# EAGLE schematic fri3d_badge_2016 (EAGLE 7.5.0)
CNAME: Fri3d Camp Badge; CREVISION: 0; DESIGNER: Christophe VG
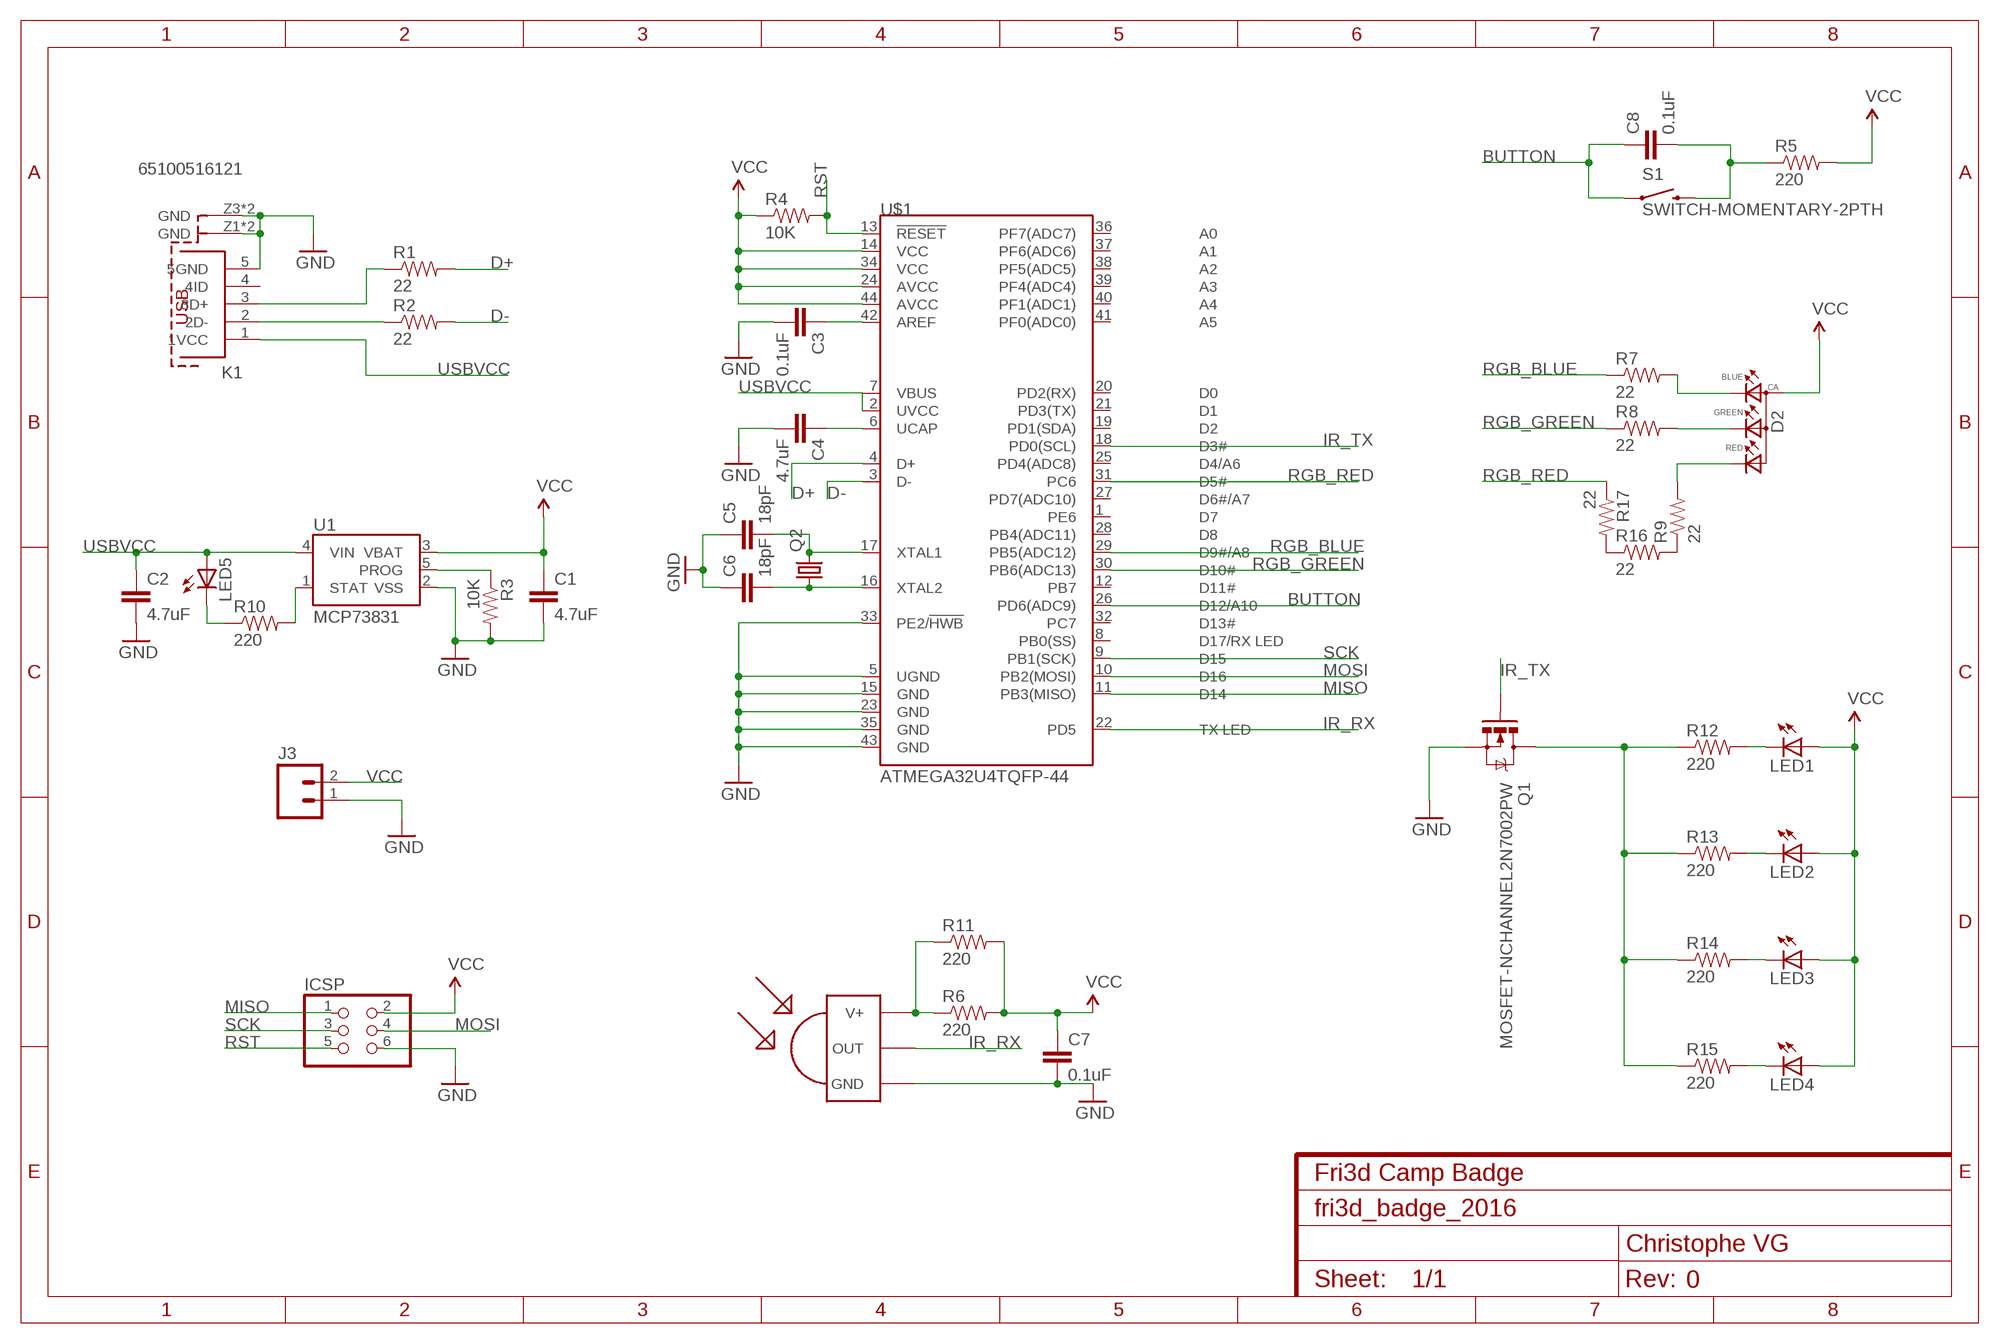
[diagram p0: schematic, sheet 1]

## Parts
C1  4.7uF  CAP0805  [0805]
C2  4.7uF  CAP0805  [0805]
C3  0.1uF  CAP0805  [0805]
C4  4.7uF  CAP0805  [0805]
C5  18pF  CAP0805  [0805]
C6  18pF  CAP0805  [0805]
C7  0.1uF  CAP0805  [0805]
C8  0.1uF  CAP0805  [0805]
D2  0.13_RGB_LEDPLCC  [P-LCC-4-3]
ICSP  PINHD-2X3  [2X03]
J3  M02JST-PTH-VERT  [JST-2-PTH-VERT]
K1  65100516121  [65100516121]
LED1  LEDCHIPLED_0805  [CHIPLED_0805]
LED2  LEDCHIPLED_0805  [CHIPLED_0805]
LED3  LEDCHIPLED_0805  [CHIPLED_0805]
LED4  LEDCHIPLED_0805  [CHIPLED_0805]
LED5  LEDCHIPLED_0805  [CHIPLED_0805]
Q1  MOSFET-NCHANNEL2N7002PW  [SOT323]
Q2  CRYSTALHC49S  [HC49/S]
R1  22  RESISTOR0805-RES  [0805]
R2  22  RESISTOR0805-RES  [0805]
R3  10K  RESISTOR0805-RES  [0805]
R4  10K  RESISTOR0805-RES  [0805]
R5  220  RESISTOR0805-RES  [0805]
R6  220  RESISTOR0805-RES  [0805]
R7  22  RESISTOR0805-RES  [0805]
R8  22  RESISTOR0805-RES  [0805]
R9  22  RESISTOR0805-RES  [0805]
R10  220  RESISTOR0805-RES  [0805]
R11  220  RESISTOR0805-RES  [0805]
R12  220  RESISTOR0805-RES  [0805]
R13  220  RESISTOR0805-RES  [0805]
R14  220  RESISTOR0805-RES  [0805]
R15  220  RESISTOR0805-RES  [0805]
R16  22  RESISTOR0805-RES  [0805]
R17  22  RESISTOR0805-RES  [0805]
S1  SWITCH-MOMENTARY-2PTH  [TACTILE-PTH]
U1  MCP73831  [SOT23-5]
U$1  ATMEGA32U4TQFP-44  [TQFP44]
U$3  TSOP4838  [TSOP18XX]

## Nets
BUTTON: C8.1 S1.1 U$1.26(PD6(ADC9))
D+: R1.2 U$1.4(D+)
D-: R2.2 U$1.3(D-)
GND: C1.2 C2.2 C3.2 C4.2 C5.1 C6.1 C7.2 ICSP.6 J3.1 K1.5(5GND) K1.Z1(GND) K1.Z2(GND) K1.Z3(GND) K1.Z4(GND) Q1.2(S) R3.2 U1.2(VSS) U$1.5(UGND) U$1.15(GND) U$1.23(GND) U$1.33(PE2/!HWB) U$1.35(GND) U$1.43(GND) U$3.GND
IR_RX: U$1.22(PD5) U$3.OUT
IR_TX: Q1.1(G) U$1.18(PD0(SCL))
MISO: ICSP.1 U$1.11(PB3(MISO))
MOSI: ICSP.4 U$1.10(PB2(MOSI))
N$1: K1.2(2D-) R2.1
N$2: K1.3(3D+) R1.1
N$3: C8.2 R5.1 S1.3
N$4: C4.1 U$1.6(UCAP)
N$5: R3.1 U1.5(PROG)
N$6: LED5.C R10.1
N$7: C3.1 U$1.42(AREF)
N$8: C5.2 Q2.2 U$1.17(XTAL1)
N$9: C6.2 Q2.1 U$1.16(XTAL2)
N$10: R6.1 R11.1 U$3.VCC(V+)
N$11: R9.1 R16.2
N$12: R16.1 R17.2
N$13: LED1.C R12.2
N$14: LED2.C R13.2
N$15: LED3.C R14.2
N$16: LED4.C R15.2
N$19: D2.3(BLUE) R7.2
N$20: D2.2(GREEN) R8.2
N$21: D2.1(RED) R9.2
N$22: R10.2 U1.1(STAT)
N$24: Q1.3(D) R12.1 R13.1 R14.1 R15.1
RGB_BLUE: R7.1 U$1.29(PB5(ADC12))
RGB_GREEN: R8.1 U$1.30(PB6(ADC13))
RGB_RED: R17.1 U$1.31(PC6)
RST: ICSP.5 R4.2 U$1.13(!RESET)
SCK: ICSP.3 U$1.9(PB1(SCK))
USBVCC: C2.1 K1.1(1VCC) LED5.A U1.4(VIN) U$1.2(UVCC) U$1.7(VBUS)
VCC: C1.1 C7.1 D2.4(ANODE) ICSP.2 J3.2 LED1.A LED2.A LED3.A LED4.A R4.1 R5.2 R6.2 R11.2 U1.3(VBAT) U$1.14(VCC) U$1.24(AVCC) U$1.34(VCC) U$1.44(AVCC)
Unconnected: K1.4(4ID) U$1.1(PE6) U$1.8(PB0(SS)) U$1.12(PB7) U$1.19(PD1(SDA)) U$1.20(PD2(RX)) U$1.21(PD3(TX)) U$1.25(PD4(ADC8)) U$1.27(PD7(ADC10)) U$1.28(PB4(ADC11)) U$1.32(PC7) U$1.36(PF7(ADC7)) U$1.37(PF6(ADC6)) U$1.38(PF5(ADC5)) U$1.39(PF4(ADC4)) U$1.40(PF1(ADC1)) U$1.41(PF0(ADC0))

## Library data of the parts
C1-C8 = SparkFun-Capacitors:CAP: Capacitor Standard 0603 ceramic capacitor, and 0.1" leaded capacitor.
D2 = SparkFun-LED:0.13_RGB_LED: Everlight Red/Green/Blue LED 67-23/R6GHBHC-B01/2T || 67-23/R6GHBH-B01 Size 3.2*2.8*1.9mm Mounting Type SMD Full-Color LED PLCC4 Emitting Color Red/Green/Blue (620-625/530-535/470-475 nm) Chip Material AlGaInP/InGaN/InGaN Luminous Intensity 57-112/225-450/36-72 mcd Viewing Angle 120 deg Lens Type-Color Water Clear Forward Voltage 2.0/3.5/3.5 V Forward Current 10 mA Maximum Forward Voltage 2.4/3.9/3.9 V Maximum Forward Current 25/25/25 mA Min-Max Operating Temperature -40C to +85C Factory Pack 2000 pcs-Reel RoHS ✓; PROD_ID: DIO-12986
ICSP = SparkFun-Connectors:PINHD-2X3: PIN HEADER
J3 = SparkFun-Connectors:M02: Standard 2-pin 0.1" header. Use with - straight break away headers ( PRT-00116) - right angle break away headers (PRT-00553) - swiss pins (PRT-00743) - machine pins (PRT-00117) - female headers (PRT-00115) Molex polarized connector foot print use with: PRT-08233 with associated crimp pins and housings. 2.54_SCREWTERM for use with PRT-10571. 3.5mm Screw Terminal footprints for PRT-08084 5mm Screw Terminal footprints for use with PRT-08432
K1 = Input-Output_Connectors_rev15d:65100516121: WR-COM SMT Horizontal 5 Contacts Mini USB Typ B=>Code : Con_I-O_COM_MiniUSB_65100516121 <http://katalog.we-online.de/media/images/eican/Con_I-O_COM_MiniUSB_65100516121_pf2.jpg> Details see: http://katalog.we-online.de/en/em/651_005_161_21 Created 2014-07-09, Karrer Zheng 2014 (C) Würth Elektronik
LED1-LED4 = led:LED: LED
LED5 = adafruit:LED: LED
Q1 = SparkFun-DiscreteSemi:MOSFET-NCHANNEL: Common NMOSFET Parts MFG P/N Store ID Prod ID FDD8780 TRANS-09984 SI7820DN TRANS-11055 FDS6630A IC-08089 2N7002PW TRANS-11151 FQP30N06L COM-10213 TRANS-10060 BSS123LT1G TRANS-08345 BSS138 TRANS-00830 BS170 2N7000; PROD_ID: TRANS-11151
Q2 = crystal:CRYSTAL: CRYSTAL; OC_FARNELL: 1667008; OC_NEWARK: unknown
R1-R17 = SparkFun-Passives:RESISTOR: Resistor Basic schematic elements and footprints for 0603, 1206, and PTH resistors.
S1 = SparkFun-Electromechanical:SWITCH-MOMENTARY-2: Various NO switches- pushbuttons, reed, etc; PROD_ID: SWCH-08441
U1 = SparkFun-PowerIC:MCP73831: Miniature single cell, fully integrated Li-Ion, Li-polymer charge management controller http://ww1.microchip.com/downloads/en/DeviceDoc/20001984g.pdf IC-09995; PROD_ID: IC-09995
U$1 = SparkFun-DigitalIC:ATMEGA32U4: Atmel 44-pin 8-bit Microcontroller with 32KBytes of ISP Flash and USB Controller
U$3 = tsop:TSOP4838: IR Receiver and Demodulator